# EAGLE design ft232 (EAGLE 6.6.0)
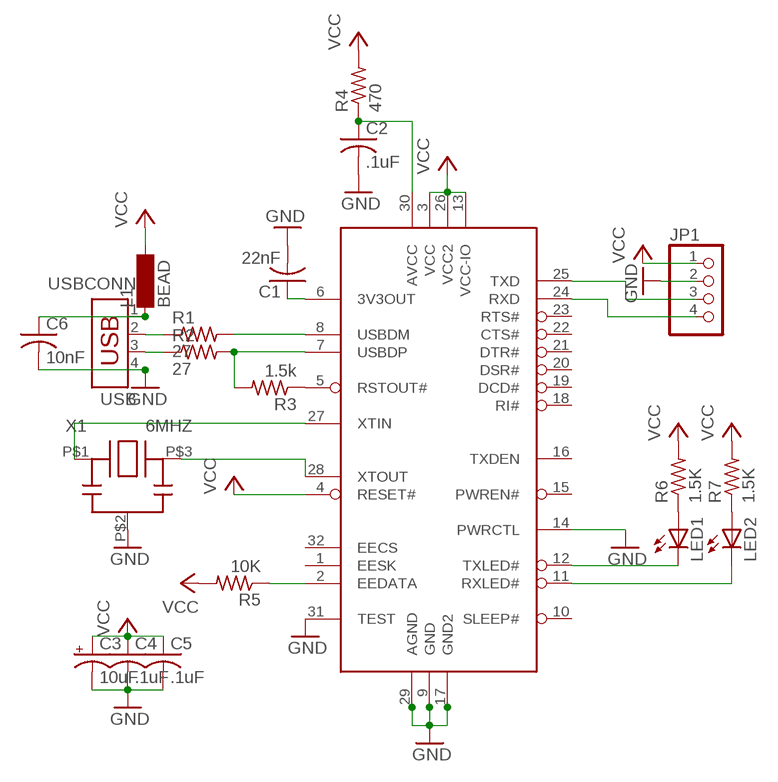
[diagram p0: schematic, sheet 1]

## Parts
C1  22nF  C-USC1206  [C1206]
C2  .1uF  C-USC1206  [C1206]
C3  10uF  CPOL-USB/3528-21R  [B/3528-21R]
C4  .1uF  C-USC1206  [C1206]
C5  .1uF  C-USC1206  [C1206]
C6  10nF  C-USC1206  [C1206]
IC1  FT232  [SQFP-S-7X7-32]
JP1  PINHD-1X4  [1X04]
L1  BEAD  SM-1206  [SM-1206]
LED1  LEDSMT1206  [1206]
LED2  LEDSMT1206  [1206]
R1  27  R-US_R1206  [R1206]
R2  27  R-US_R1206  [R1206]
R3  1.5k  R-US_R1206  [R1206]
R4  470  R-US_R1206  [R1206]
R5  10K  R-US_R1206  [R1206]
R6  1.5K  R-US_R1206  [R1206]
R7  1.5K  R-US_R1206  [R1206]
USBCONN  USB  [USB]
X1  6MHZ  ZTT  [ZTT_XTAL]

## Nets
GND: C1.2 C2.2 C3.- C4.2 C5.2 C6.2 IC1.9(GND) IC1.14(PWRCTL) IC1.17(GND2) IC1.29(AGND) IC1.31(TEST) JP1.2 USBCONN.4 X1.P$2(GND)
N$2: R1.1 USBCONN.2
N$3: R2.1 USBCONN.3
N$4: IC1.7(USBDP) R2.2 R3.2
N$5: IC1.8(USBDM) R1.2
N$6: IC1.5(RSTOUT#) R3.1
N$7: C2.1 IC1.30(AVCC) R4.1
N$8: C1.1 IC1.6(3V3OUT)
N$9: IC1.2(EEDATA) R5.1
N$10: IC1.28(XTOUT) X1.P$3(OUT)
N$11: IC1.27(XTIN) X1.P$1(IN)
N$12: IC1.25(TXD) JP1.3
N$13: IC1.24(RXD) JP1.4
N$14: IC1.11(RXLED#) LED2.C
N$15: IC1.12(TXLED#) LED1.C
N$16: LED1.A R6.1
N$17: LED2.A R7.1
N$19: C6.1 L1.1 USBCONN.1
VCC: C3.+ C4.1 C5.1 IC1.3(VCC) IC1.4(RESET#) IC1.13(VCC-IO) IC1.26(VCC2) JP1.1 L1.2 R4.2 R5.2 R6.2 R7.2
Unconnected: IC1.1(EESK) IC1.10(SLEEP#) IC1.15(PWREN#) IC1.16(TXDEN) IC1.18(RI#) IC1.19(DCD#) IC1.20(DSR#) IC1.21(DTR#) IC1.22(CTS#) IC1.23(RTS#) IC1.32(EECS)

## Library data of the parts
C1 C2 C4-C6 = rcl:C-US: CAPACITOR, American symbol
C3 = rcl:CPOL-US: POLARIZED CAPACITOR, American symbol
IC1 = usbtoys:FT232
JP1 = pinhead:PINHD-1X4: PIN HEADER
L1 = inductor-neosid:SM-1206: INDUCTOR SMD chip inductor; OC_FARNELL: unknown; OC_NEWARK: unknown
LED1 LED2 = led:LED: LED OSRAM: - CHIPLED LG R971, LG N971, LY N971, LG Q971, LY Q971, LO R971, LY R971 LH N974, LH R974 LS Q976, LO Q976, LY Q976 LO Q996 - Hyper CHIPLED LW Q18S LB Q993, LB Q99A, LB R99A - SideLED LS A670, LO A670, LY A670, LG A670, LP A670 LB A673, LV A673, LT A673, LW A673 LH A674 LY A675 LS A676, LA A676, LO A676, LY A676, LW A676 LS A679, LY A679, LG A679 - Hyper Micro SIDELED® LS Y876, LA Y876, LO Y876, LY Y876 LT Y87S - SmartLED LW L88C, LW L88S LB L89C, LB L89S, LG L890 LS L89K, LO L89K, LY L89K LS L896, LA L896, LO L896, LY L896 - TOPLED LS T670, LO T670, LY T670, LG T670, LP T670 LSG T670, LSP T670, LSY T670, LOP T670, LYG T670 LG T671, LOG T671, LSG T671 LB T673, LV T673, LT T673, LW T673 LH T674 LS T676, LA T676, LO T676, LY T676, LB T676, LH T676, LSB T676, LW T676 LB T67C, LV T67C, LT T67C, LS T67K, LO T67K, LY T67K, LW E67C LS E67B, LA E67B, LO E67B, LY E67B, LB E67C, LV E67C, LT E67C LW T67C LS T679, LY T679, LG T679 LS T770, LO T770, LY T770, LG T770, LP T770 LB T773, LV T773, LT T773, LW T773 LH T774 LS E675, LA E675, LY E675, LS T675 LS T776, LA T776, LO T776, LY T776, LB T776 LHGB T686 LT T68C, LB T68C - Hyper Mini TOPLED® LB M676 - Mini TOPLED Santana® LG M470 LS M47K, LO M47K, LY M47K Source: http://www.osram.convergy.de LUXEON: - LUMILED® LXK2-PW12-R00, LXK2-PW12-S00, LXK2-PW14-U00, LXK2-PW14-V00 LXK2-PM12-R00, LXK2-PM12-S00, LXK2-PM14-U00 LXK2-PE12-Q00, LXK2-PE12-R00, LXK2-PE12-S00, LXK2-PE14-T00, LXK2-PE14-U00 LXK2-PB12-K00, LXK2-PB12-L00, LXK2-PB12-M00, LXK2-PB14-N00, LXK2-PB14-P00, LXK2-PB14-Q00 LXK2-PR12-L00, LXK2-PR12-M00, LXK2-PR14-Q00, LXK2-PR14-R00 LXK2-PD12-Q00, LXK2-PD12-R00, LXK2-PD12-S00 LXK2-PH12-R00, LXK2-PH12-S00 LXK2-PL12-P00, LXK2-PL12-Q00, LXK2-PL12-R00 Source: www.luxeon.com KINGBRIGHT: KA-3528ASYC Source: www.kingbright.com
R1-R7 = rcl:R-US_: RESISTOR, American symbol
USBCONN = usbtoys:USB
X1 = usbtoys:ZTT

## Board
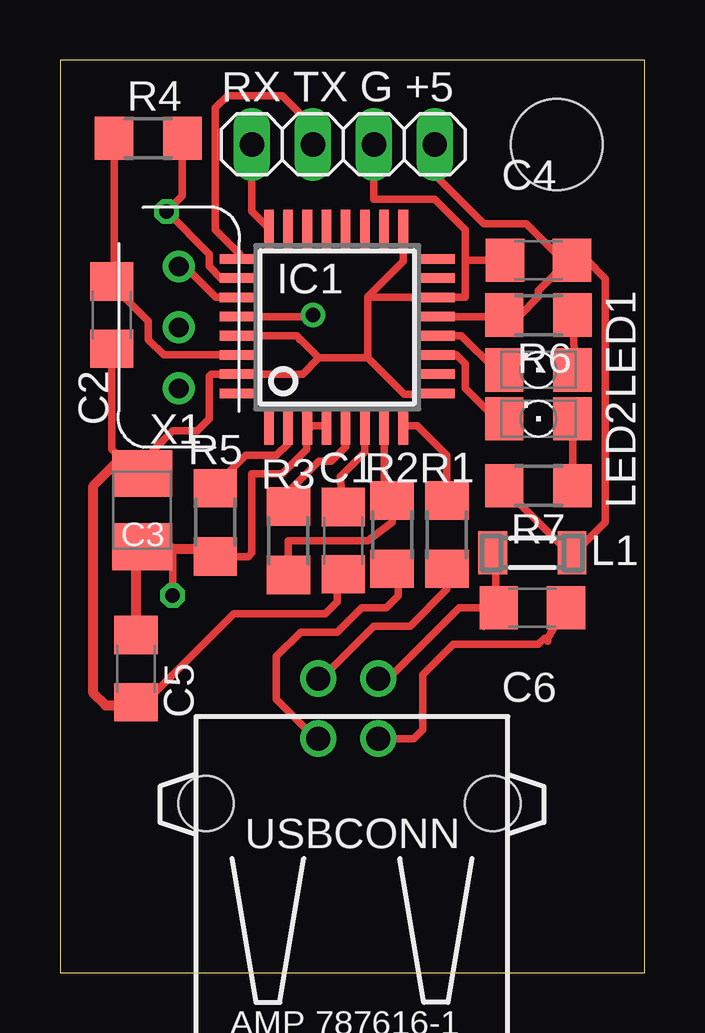
[diagram p1: board, top side]
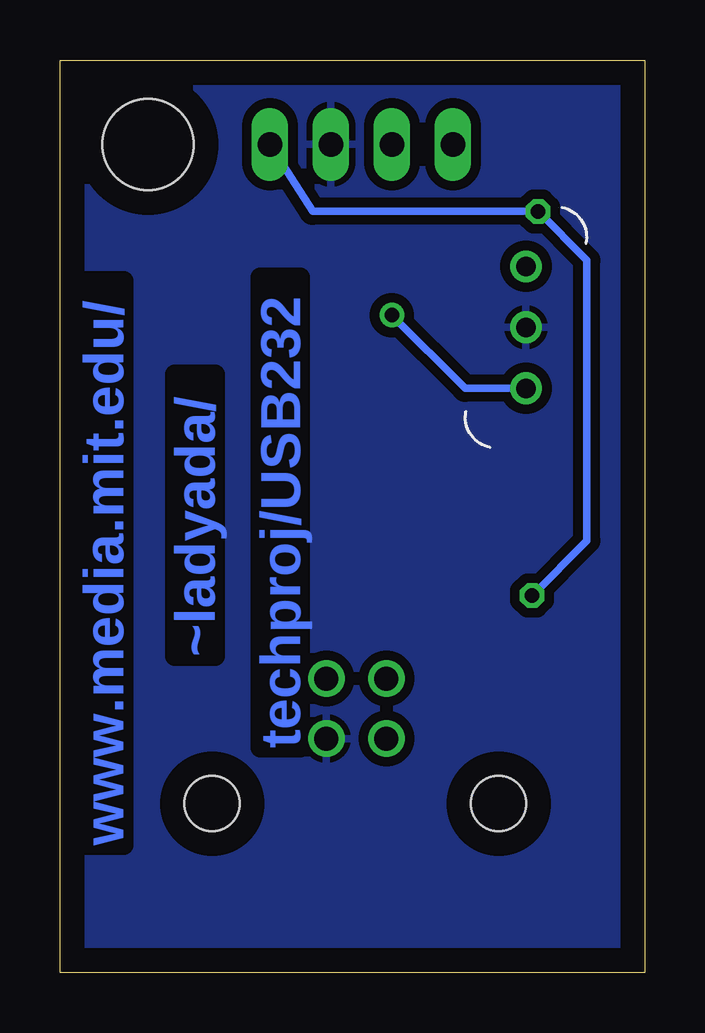
[diagram p2: board, bottom side, seen from below]

Size 24.36 x 38.02 mm. Coordinates in mm from the lower left corner, seen from the top.
Outline: 0,0 24.36,0 24.36,38.02 0,38.02 0,0
Copper layers (1*16): Top 0.035mm / dielectric 1.5mm / Bottom 0.035mm
Design rules "default": minimum track width 10mil, minimum drill 24mil, track to track 8mil, track to pad 8mil, pad to pad 8mil, via to via 8mil, smd to smd 8mil, copper to edge 40mil, drill to drill 8mil, minimum pad ring 10mil, minimum via ring 8mil, stop-mask expansion 4mil, vias tented up to drill 0mil, thermal gap 10mil
Holes 3.81 mm at 20.7,34.51

### Footprints (pad centres in the part's own frame; a part is rotated, then mirrored left to right if it is on the bottom)
C1206 = smd 1.6 x 1.8: 1 -1.4,0; 2 1.4,0
B/3528-21R = smd 1.95 x 2.5: + 1.525,0; - -1.525,0
SQFP-S-7X7-32 = smd 0.4 x 1.6: 1 -2.85,-4.1; 2 -2.05,-4.1; 3 -1.25,-4.1; 4 -0.45,-4.1; 5 0.35,-4.1; 6 1.15,-4.1; 7 1.95,-4.1; 8 2.75,-4.1; 17 2.75,4.1; 18 1.95,4.1; 19 1.15,4.1; 20 0.35,4.1; 21 -0.45,4.1; 22 -1.25,4.1; 23 -2.05,4.1; 24 -2.85,4.1 | smd 1.6 x 0.4: 9 4.1,-2.75; 10 4.1,-1.95; 11 4.1,-1.15; 12 4.1,-0.35; 13 4.1,0.45; 14 4.1,1.25; 15 4.1,2.05; 16 4.1,2.85; 25 -4.1,2.85; 26 -4.1,2.05; 27 -4.1,1.25; 28 -4.1,0.45; 29 -4.1,-0.35; 30 -4.1,-1.15; 31 -4.1,-1.95; 32 -4.1,-2.75
1X04 = drill 1.016 long: 1 -3.81,0; 2 -1.27,0; 3 1.27,0; 4 3.81,0
SM-1206 = smd 1.2 x 1.8: 1 -1.65,0; 2 1.65,0
1206 = smd 1.6 x 1.803: A -1.422,0; C 1.422,0
R1206 = smd 1.6 x 1.803: 1 -1.422,0; 2 1.422,0
USB = drill 1: 1 1.2,15.59; 2 -1.3,15.59; 3 -1.3,13.09; 4 1.2,13.09 | hole 2.3: -5.97,10.38; 5.97,10.38
ZTT_XTAL = drill 0.813: P$1 -2.54,0; P$2 0,0; P$3 2.54,0

### Placement (x,y rotation side)
C1  11.81,18 270 top
C2  2.15,27.39 270 top
C3  3.42,19.27 270 top
C4  19.93,29.68 180 top
C5  3.17,12.66 270 top
C6  19.68,15.2 0 top
IC1  11.55,26.89 0 top
JP1  11.81,34.51 180 top
L1  19.68,17.49 0 top
LED1  19.93,25.11 180 top
LED2  19.93,23.08 180 top
R1  16.12,18.25 90 top
R2  13.84,18.25 90 top
R3  9.52,18 270 top
R4  3.68,34.76 0 top
R5  6.47,18.76 270 top
R6  19.93,27.39 180 top
R7  19.93,20.28 180 top
USBCONN  12.06,-3.34 0 top
X1  4.95,26.89 270 top

### Tracks (layer width: path | path; a pad name or v marks a point on that pad's centre or on a via)
GND
  Top 0.305: C3.- 2.99,20.87 3.04,20.92 | 3.04,20.92 4.69,22.57 5.71,22.57 6.22,23.08 6.22,24.85 6.3,24.94 IC1.31 10.11,24.94 10.79,25.62 | 16.89,29.17 16.89,28.14 IC1.14 12.84,28.14 12.82,28.16 | 16.89,29.17 16.89,30.95 15.62,32.22 13.08,32.22 JP1.2 | C1.2 11.55,15.96 11.55,15.46 11.04,14.95 7.23,14.95 3.68,11.39 C5.2 | 20.32,13.93 C6.2 | 20.32,13.93 20.32,13.81 | 12.82,28.16 14.3,29.64 IC1.17 | 15.65,24.09 15.87,24.09 | 15.65,24.09 IC1.9 | 12.82,25.62 14.35,24.09 15.65,24.09 | 12.82,25.62 12.82,28.16 | 10.03,26.38 9.99,26.38 | 10.79,25.62 10.03,26.38 | 10.79,25.62 12.82,25.62 | USBCONN.4 14.74,9.75 15.11,10.12 15.11,12.41 16.38,13.68 19.93,13.68 20.19,13.93 20.32,13.93 | C2.2 2.15,21.81 2.53,21.43 3.04,20.92 | IC1.29 9.87,26.54 10.03,26.38 | C4.2 16.89,29.68 16.89,29.17
  Top 0.406: 2.53,21.43 1.39,20.28 1.39,11.65 1.9,11.14 3.17,11.14 C5.2
  pour Bottom (isolate 0.406): 0.12,37.81 0.12,0.22 24.25,0.22 24.25,37.81
N$2
  Top 0.305: 15.87,16.98 16.12,17.23 R1.1 16.12,15.96 14.6,14.44 13.08,14.44 10.89,12.25 USBCONN.2
N$3
  Top 0.305: 13.58,16.98 13.84,17.23 R2.1 13.84,16.73 14.09,16.47 14.09,15.71 13.58,15.2 12.57,15.2 11.55,14.19 10.03,14.19 9.01,13.17 9.01,11.39 10.65,9.75 USBCONN.3
N$4
  Top 0.305: R2.2 13.69,20.18 13.5,20.36 IC1.7 | R3.2 9.52,18 12.82,18 13.84,18.76 R2.2 | R2.2 13.84,20.28
N$5
  Top 0.305: IC1.8 14.89,22.79 16.12,21.55 R1.2
N$6
  Top 0.305: IC1.5 11.9,21.9 11.3,21.3 10.79,21.3 9.52,20.03 R3.1
N$7
  Top 0.305: C2.1 2.15,28.66 2.26,28.77 | 2.26,28.77 R4.1 | 2.26,28.77 2.26,28.56 3.68,27.14 3.68,26.38 4.32,25.74 IC1.30
N$8
  Top 0.305: IC1.6 12.7,21.69 11.68,20.67 C1.1
N$9
  Top 0.305: IC1.2 9.5,22.04 9.01,21.55 7.74,21.55 6.47,20.28 R5.1
N$10  (via drill 0.61)
  Top 0.305: 10.28,27.39 v10.54,27.39 10.48,27.34 IC1.28
  Bottom 0.305: X1.P$3 7.49,24.35 v10.54,27.39
N$11
  Top 0.305: X1.P$1 4.95,29.68 6.49,28.14 IC1.27
N$12
  Top 0.305: JP1.3 10.54,35.27 9.27,36.54 6.98,36.54 6.47,36.03 6.47,30.95 7.49,29.93 7.45,29.9 IC1.25
N$13
  Top 0.305: IC1.24 8.7,31.01 8,31.71 JP1.4
N$14
  Top 0.305: IC1.11 16.51,25.74 16.89,25.36 16.89,24.35 18.16,23.08 LED2.C
N$15
  Top 0.305: LED1.C 18.16,25.11 16.73,26.54 IC1.12
N$16
  Top 0.305: LED1.A 21.2,25.11 21.46,25.36 R6.1
N$17
  Top 0.305: LED2.A 21.46,23.08 21.36,22.97 R7.1
N$19
  Top 0.305: L1.1 18.03,17.36 17.9,17.23 18.16,16.98 18.16,14.95 17.65,14.44 C6.1 16.63,15.2 13.68,12.25 USBCONN.1
VCC  (via drill 0.61)
  Top 0.305: 10.3,22.59 10.28,22.57 10.28,21.81 9.27,20.79 8,20.79 8,17.49 7.84,17.34 6.73,17.34 R5.2 6.47,17.23 6.04,17.67 | 10.3,22.59 IC1.3 | IC1.4 10.5,22.79 10.3,22.59 | R7.2 18.41,20.28 21.2,17.49 L1.2 21.46,17.49 22.73,18.76 22.73,27.9 | 22.73,27.9 22.73,28.16 | IC1.26 6.71,28.94 6.22,29.43 6.22,29.93 v4.44,31.71 5.1,32.37 R4.2 | 4.69,17.67 v4.69,15.71 | 18.66,27.39 R6.2 | IC1.13 18.61,27.34 arc90 18.66,27.39 | 22.73,27.9 22.73,28.92 21.97,29.68 C4.1 21.2,29.68 | 18.66,27.39 19.17,27.39 19.93,28.16 19.93,28.41 21.2,29.68 | 21.2,29.68 20.95,29.68 19.43,31.2 17.65,31.2 15.62,33.24 JP1.1
  Top 0.406: 6.73,17.34 6.73,17.67 4.69,17.67 2.66,17.67 C3.+ | C3.+ 2.66,17.74 | C3.+ 3.17,17.74 C5.1
  Bottom 0.305: v4.69,15.71 2.41,18 2.41,29.68 v4.44,31.71 13.84,31.71 JP1.1

### Text on the board
Bottom: ~ladyada/ | techproj/USB232 | www.media.mit.edu/
tPlace: RX TX G +5